# EAGLE design legacy-wing-v1 (EAGLE 9.1.0)
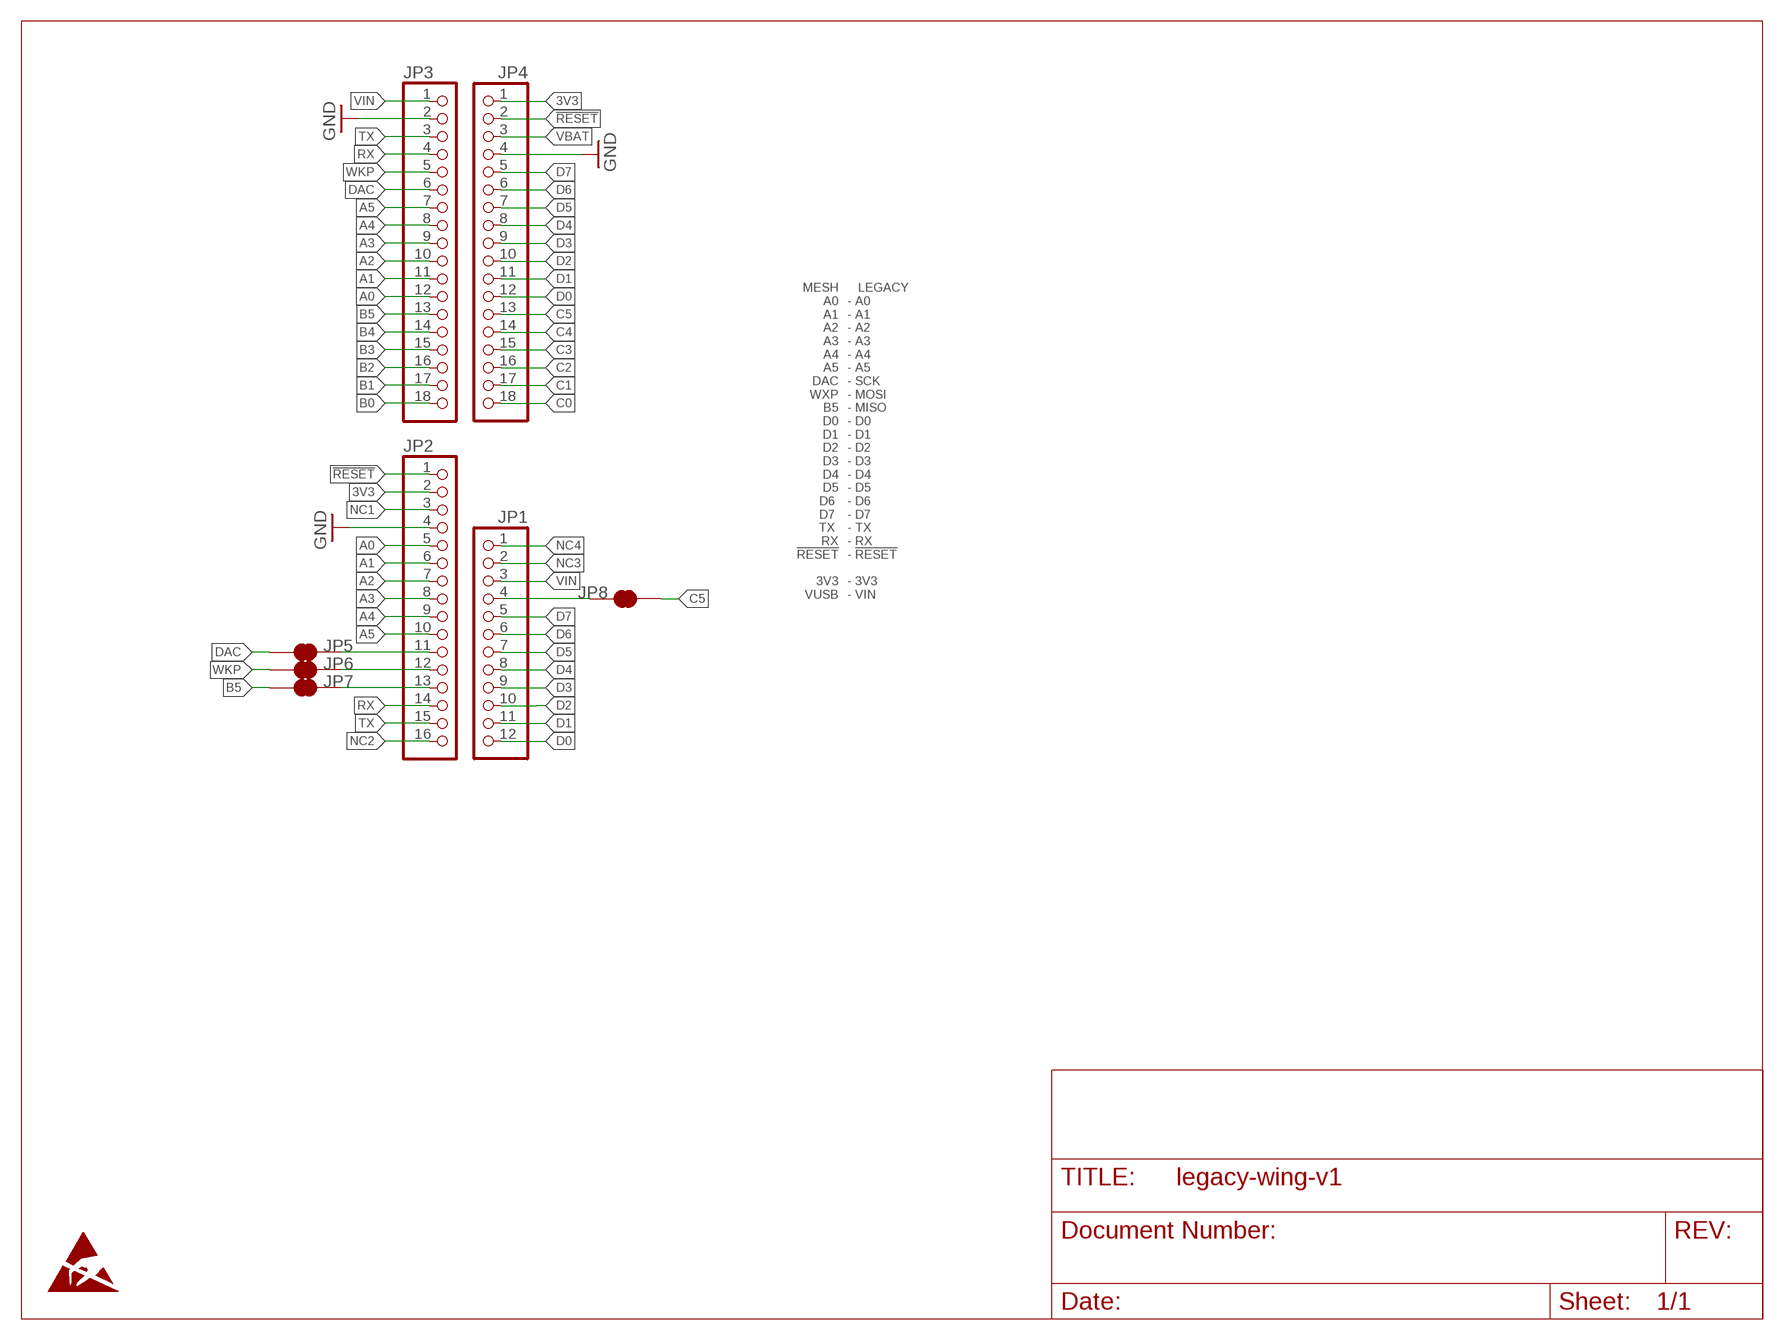
[diagram p0: schematic, sheet 1]

## Parts
JP1  PINHD-1X121X12_SMT  [1X12_SMT]
JP2  PINHD-1X161X16_SMT  [1X16_SMT]
JP3  PINHD-1X181X18_SMT  [1X18_SMT]
JP4  PINHD-1X181X18_SMT  [1X18_SMT]
JP5  JUMPER-SMT_2_NC_TRACE_NO-SILK  [SMT-JUMPER_2_NC_TRACE_NO-SILK]
JP6  JUMPER-SMT_2_NC_TRACE_NO-SILK  [SMT-JUMPER_2_NC_TRACE_NO-SILK]
JP7  JUMPER-SMT_2_NC_TRACE_NO-SILK  [SMT-JUMPER_2_NC_TRACE_NO-SILK]
JP8  JUMPER-SMT_2_NC_TRACE_NO-SILK  [SMT-JUMPER_2_NC_TRACE_NO-SILK]

## Nets
3V3: JP2.2 JP4.1
!RESET: JP2.1 JP4.2
A0: JP2.5 JP3.12
A1: JP2.6 JP3.11
A2: JP2.7 JP3.10
A3: JP2.8 JP3.9
A4: JP2.9 JP3.8
A5: JP2.10 JP3.7
B0: JP3.18
B1: JP3.17
B2: JP3.16
B3: JP3.15
B4: JP3.14
B5: JP3.13 JP7.1
C0: JP4.18
C1: JP4.17
C2: JP4.16
C3: JP4.15
C4: JP4.14
C5: JP4.13 JP8.2
D0: JP1.12 JP4.12
D1: JP1.11 JP4.11
D2: JP1.10 JP4.10
D3: JP1.9 JP4.9
D4: JP1.8 JP4.8
D5: JP1.7 JP4.7
D6: JP1.6 JP4.6
D7: JP1.5 JP4.5
DAC: JP3.6 JP5.1
GND: JP2.4 JP3.2 JP4.4
N$1: JP2.11 JP5.2
N$2: JP2.12 JP6.2
N$3: JP2.13 JP7.2
N$4: JP1.4 JP8.1
NC1: JP2.3
NC2: JP2.16
NC3: JP1.2
NC4: JP1.1
RX: JP2.14 JP3.4
TX: JP2.15 JP3.3
VBAT: JP4.3
VIN: JP1.3 JP3.1
WKP: JP3.5 JP6.1

## Notes on the sheet
- MESH
  A0
  A1
  A2
  A3
  A4
  A5
  DAC
  WXP
  B5
  D0
  D1
  D2
  D3
  D4
  D5
  D6 
  D7 
  TX 
  RX
  !RESET
  
  3V3
  VUSB
- LEGACY
  - A0
  - A1
  - A2
  - A3
  - A4
  - A5
  - SCK
  - MOSI
  - MISO
  - D0
  - D1
  - D2
  - D3
  - D4
  - D5
  - D6 
  - D7 
  - TX 
  - RX
  - !RESET
  
  - 3V3
  - VIN

## Library data of the parts
JP1 = pinhead+:PINHD-1X12: PIN HEADER
JP2 = pinhead+:PINHD-1X16: PIN HEADER
JP3 JP4 = pinhead+:PINHD-1X18: PIN HEADER
JP5-JP8 = SparkFun-Jumpers:JUMPER-SMT_2_NC_TRACE: Normally closed trace jumper This jumper has a trace between two pads so it's normally closed (NC). Use a razor knife to open the connection. For best results follow the IPC guidelines for cutting traces: Cutout at least 0.063 mm (0.005 in). Remove all loose material to clean up the cut area. Seal the cut with an approved epoxy. Reapply solder to reclose the connection.

## Board
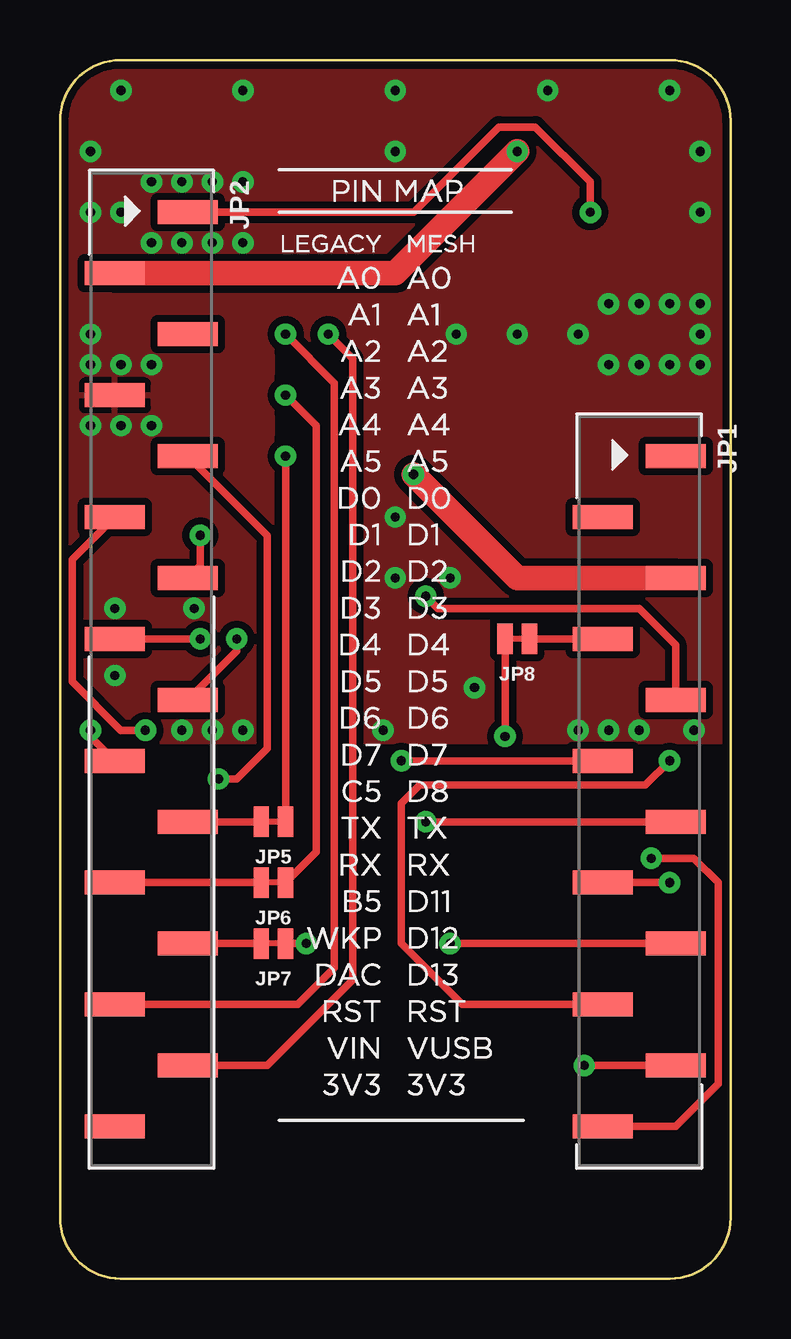
[diagram p1: board, top side]
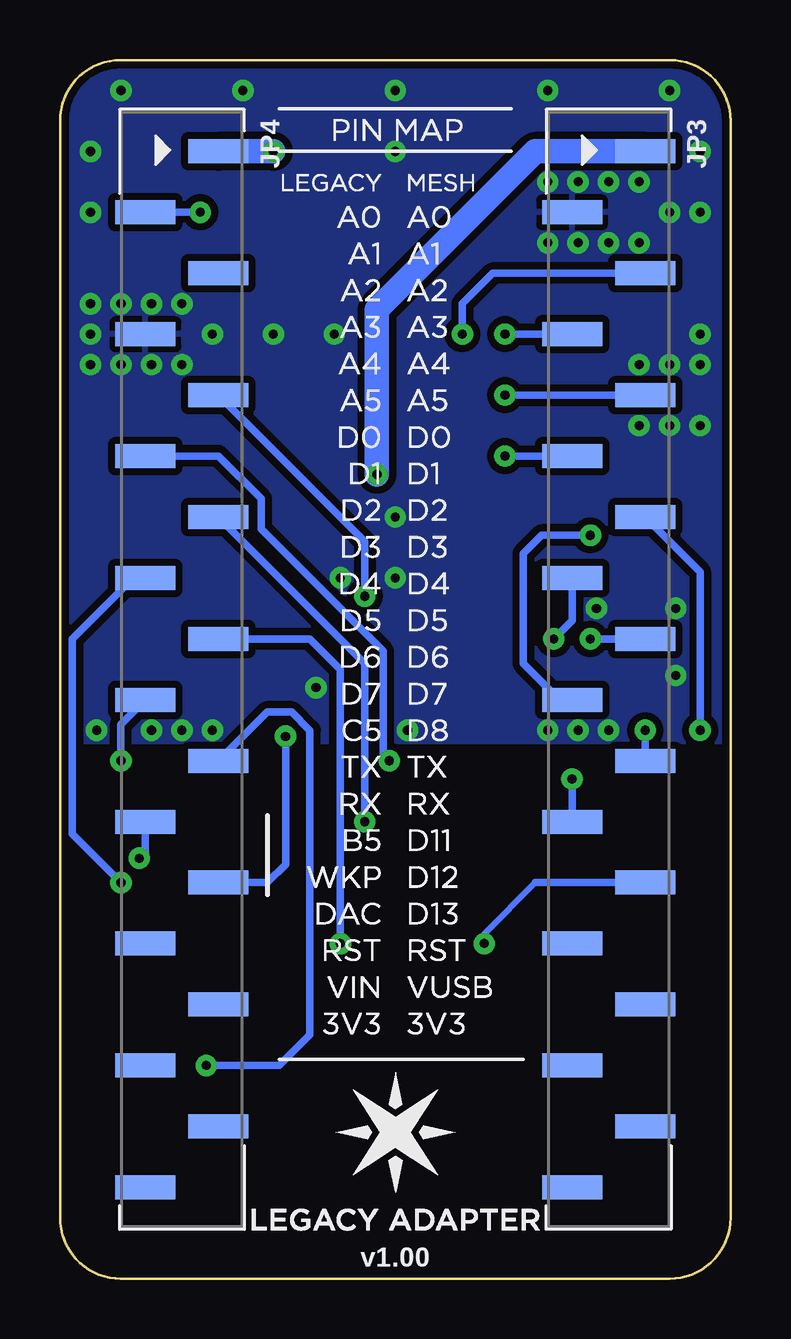
[diagram p2: board, bottom side, seen from below]

Size 27.94 x 50.8 mm. Coordinates in mm from the lower left corner, seen from the top.
Outline: 2.54,0 arc-90 0,2.54 0,48.26 arc-90 2.54,50.8 25.4,50.8 arc-90 27.94,48.26 27.94,2.54 arc-90 25.4,0 2.54,0
Copper layers (1*16): Top 0.035mm / dielectric 1.5mm / Bottom 0.035mm
Design rules "SparkFun-2-layer-STANDARD": minimum track width 10mil, minimum drill 20mil, track to track 10mil, track to pad 8mil, pad to pad 8mil, via to via 10mil, smd to smd 8mil, copper to edge 8mil, drill to drill 8mil, minimum pad ring 10mil, minimum via ring 10mil, stop-mask expansion 4mil, vias tented up to drill 25mil, thermal gap 10mil
tRestrict: 2 lines

### Footprints (pad centres in the part's own frame; a part is rotated, then mirrored left to right if it is on the bottom)
1X12_SMT = smd 1 x 2.5: 1 -13.97,1.52; 2 -11.43,-1.52; 3 -8.89,1.52; 4 -6.35,-1.52; 5 -3.81,1.52; 6 -1.27,-1.52; 7 1.27,1.52; 8 3.81,-1.52; 9 6.35,1.52; 10 8.89,-1.52; 11 11.43,1.52; 12 13.97,-1.52
1X16_SMT = smd 1 x 2.5: 1 -19.05,1.52; 2 -16.51,-1.52; 3 -13.97,1.52; 4 -11.43,-1.52; 5 -8.89,1.52; 6 -6.35,-1.52; 7 -3.81,1.52; 8 -1.27,-1.52; 9 1.27,1.52; 10 3.81,-1.52; 11 6.35,1.52; 12 8.89,-1.52; 13 11.43,1.52; 14 13.97,-1.52; 15 16.51,1.52; 16 19.05,-1.52
1X18_SMT = smd 1 x 2.5: 1 -21.59,1.52; 2 -19.05,-1.52; 3 -16.51,1.52; 4 -13.97,-1.52; 5 -11.43,1.52; 6 -8.89,-1.52; 7 -6.35,1.52; 8 -3.81,-1.52; 9 -1.27,1.52; 10 1.27,-1.52; 11 3.81,1.52; 12 6.35,-1.52; 13 8.89,1.52; 14 11.43,-1.52; 15 13.97,1.52; 16 16.51,-1.52; 17 19.05,1.52; 18 21.59,-1.52
SMT-JUMPER_2_NC_TRACE_NO-SILK = smd 0.635 x 1.27: 1 -0.508,0; 2 0.508,0

### Placement (x,y rotation side)
JP1  24.13,20.32 270 top
JP2  3.81,25.4 270 top
JP3  5.08,25.4 270 bottom
JP4  22.86,25.4 270 bottom
JP5  8.89,19.05 180 top
JP6  8.89,16.51 180 top
JP7  8.89,13.97 180 top
JP8  19.05,26.67 180 top
U$1  [PARTICLE_LOGO_5MM]  13.97,6.1 0 bottom

### Tracks (layer width: path | path; a pad name or v marks a point on that pad's centre or on a via)
3V3  (via drill 0.38)
  Top 1.016: JP2.2 13.97,41.91 v19.05,46.99
  Bottom 1.016: v19.05,46.99 JP4.1
!RESET  (via drill 0.38)
  Top 0.305: v22.1,44.45 22.1,45.72 19.81,48.01 18.29,48.01 14.73,44.45 JP2.1
  Bottom 0.305: v22.1,44.45 JP4.2
A0  (via drill 0.38)
  Top 0.305: JP2.5 8.64,30.98 8.64,22.1 7.37,20.83 v6.6,20.83
  Bottom 0.305: v6.6,20.83 v6.6,20.82 JP3.12
A1  (via drill 0.38)
  Top 0.305: JP2.6 0.51,29.97 0.51,24.89 2.54,22.86 v3.56,22.86
  Bottom 0.305: v3.56,22.86 JP3.11
A2  (via drill 0.38)
  Top 0.305: v5.84,30.99 5.84,29.72 JP2.7
  Bottom 0.305: JP3.10 7.11,24.13 8.64,25.65 8.64,30.23 7.87,30.99 v5.84,30.99
A3  (via drill 0.38)
  Top 0.305: JP2.8 v5.84,26.67
  Bottom 0.305: v5.84,26.67 JP3.9
A4  (via drill 0.38)
  Top 0.305: v7.37,26.67 7.37,26.17 JP2.9
  Bottom 0.305: JP3.8 6.6,27.44 v7.37,26.67
A5  (via drill 0.38)
  Top 0.305: v1.27,22.86 1.27,22.61 JP2.10
  Bottom 0.305: JP3.7 1.27,29.46 v1.27,22.86
B5  (via drill 0.38)
  Top 0.305: JP7.1 v10.26,13.97
  Bottom 0.254: v10.26,13.97 10.26,14.38 8.13,16.51
  Bottom 0.305: 8.13,16.51 JP3.13
C5  (via drill 0.38)
  Top 0.305: JP8.2 v18.54,22.61
  Bottom 0.305: JP4.13 19.3,16.51 18.54,17.27 v18.54,22.61
D0  (via drill 0.38)
  Top 0.305: v24.64,17.53 26.42,17.53 27.43,16.51 27.43,8.13 25.65,6.35 JP1.12
  Bottom 0.305: v24.64,17.53 24.38,17.78 JP4.12
D1  (via drill 0.38)
  Top 0.305: v21.84,8.89 JP1.11
  Bottom 0.305: v21.84,8.89 18.8,8.89 17.53,10.16 17.53,22.86 18.29,23.62 19.31,23.62 JP4.11
D2  (via drill 0.38)
  Top 0.305: v25.4,21.59 24.38,20.57 14.99,20.57 14.22,19.81 14.22,13.97 16.76,11.43 JP1.10
  Bottom 0.305: v25.4,21.59 25.4,23.11 JP4.10
D3  (via drill 0.38)
  Top 0.305: v16.26,13.97 JP1.9
  Bottom 0.305: JP4.9 18.54,26.67 17.53,26.67 16.26,25.4 v16.26,13.97
D4  (via drill 0.38)
  Top 0.305: JP1.8 v25.4,16.51
  Bottom 0.305: JP4.8 24.89,29.21 27.43,26.67 27.43,18.54 v25.4,16.51
D5  (via drill 0.38)
  Top 0.305: v15.24,19.05 JP1.7
  Bottom 0.305: JP4.7 15.24,25.65 v15.24,19.05
D6  (via drill 0.38)
  Top 0.305: JP1.6 v14.22,21.59
  Bottom 0.305: v14.22,21.59 14.48,21.84 14.48,26.16 19.56,31.24 19.56,32.51 21.34,34.29 JP4.6
D7  (via drill 0.38)
  Top 0.305: JP1.5 25.65,26.42 24.13,27.94 15.75,27.94 v15.24,28.45
  Bottom 0.305: JP4.5 15.24,30.73 v15.24,28.45
DAC  (via drill 0.38)
  Top 0.305: JP5.1 v9.4,34.29
  Bottom 0.305: v9.4,34.29 JP3.6
GND  (via drill 0.38)
  other vias: 2.54,49.53 13.97,49.53 25.4,49.53 20.32,49.53 7.62,49.53 1.27,38.1 2.54,38.1 3.81,38.1 26.67,39.37 26.67,40.64 25.4,40.64 24.13,40.64 2.54,44.45 1.27,44.45 21.59,39.37 19.05,39.37 16.51,39.37 26.67,44.45 26.67,46.99 1.27,46.99 13.97,46.99 1.27,39.37 24.13,38.1 25.4,38.1 26.67,38.1 22.86,38.1 22.86,40.64 5.08,43.18 6.35,43.18 7.62,43.18 3.81,43.18 3.81,45.72 7.62,45.72 6.35,45.72 1.27,35.56 2.54,35.56 3.81,35.56 21.59,22.86 22.86,22.86 24.13,22.86 5.08,22.86 6.35,22.86 7.62,22.86 5.08,45.72 13.46,22.86 13.97,31.75 13.97,29.21 16.26,29.21 17.27,24.64 26.42,22.86 2.29,25.15 2.29,27.94 5.59,27.94
  pour Bottom (isolate 0.305): 0,22.35 27.94,22.35 27.94,50.8 0,50.8
  pour Top (isolate 0.305): 0,22.35 27.94,22.35 27.94,50.8 0,50.8
N$1
  Top 0.305: JP5.2 JP2.11
N$2
  Top 0.305: JP6.2 JP2.12
N$3
  Top 0.305: JP7.2 JP2.13
N$4
  Top 0.305: JP8.1 21.08,26.67 JP1.4
RX  (via drill 0.38)
  Top 0.305: JP2.14 9.91,11.43 11.43,12.95 11.43,37.34 v9.4,39.37
  Bottom 0.305: v9.4,39.37 JP3.4
TX  (via drill 0.38)
  Top 0.305: JP2.15 8.64,8.89 12.19,12.45 12.19,38.35 v11.18,39.37
  Bottom 0.305: v11.18,39.37 11.18,40.64 9.91,41.91 JP3.3
VIN  (via drill 0.38)
  Top 1.016: JP1.3 19.05,29.21 v14.73,33.53
  Bottom 1.016: JP3.1 8.13,46.99 14.73,40.39 v14.73,33.53
WKP  (via drill 0.38)
  Top 0.305: JP6.1 10.67,17.78 10.67,35.56 v9.4,36.83
  Bottom 0.305: v9.4,36.83 JP3.5

### Text on the board
bPlace: v1.00